# Altium project QUTMS_SteeringWheelV2-V00.PrjPcb
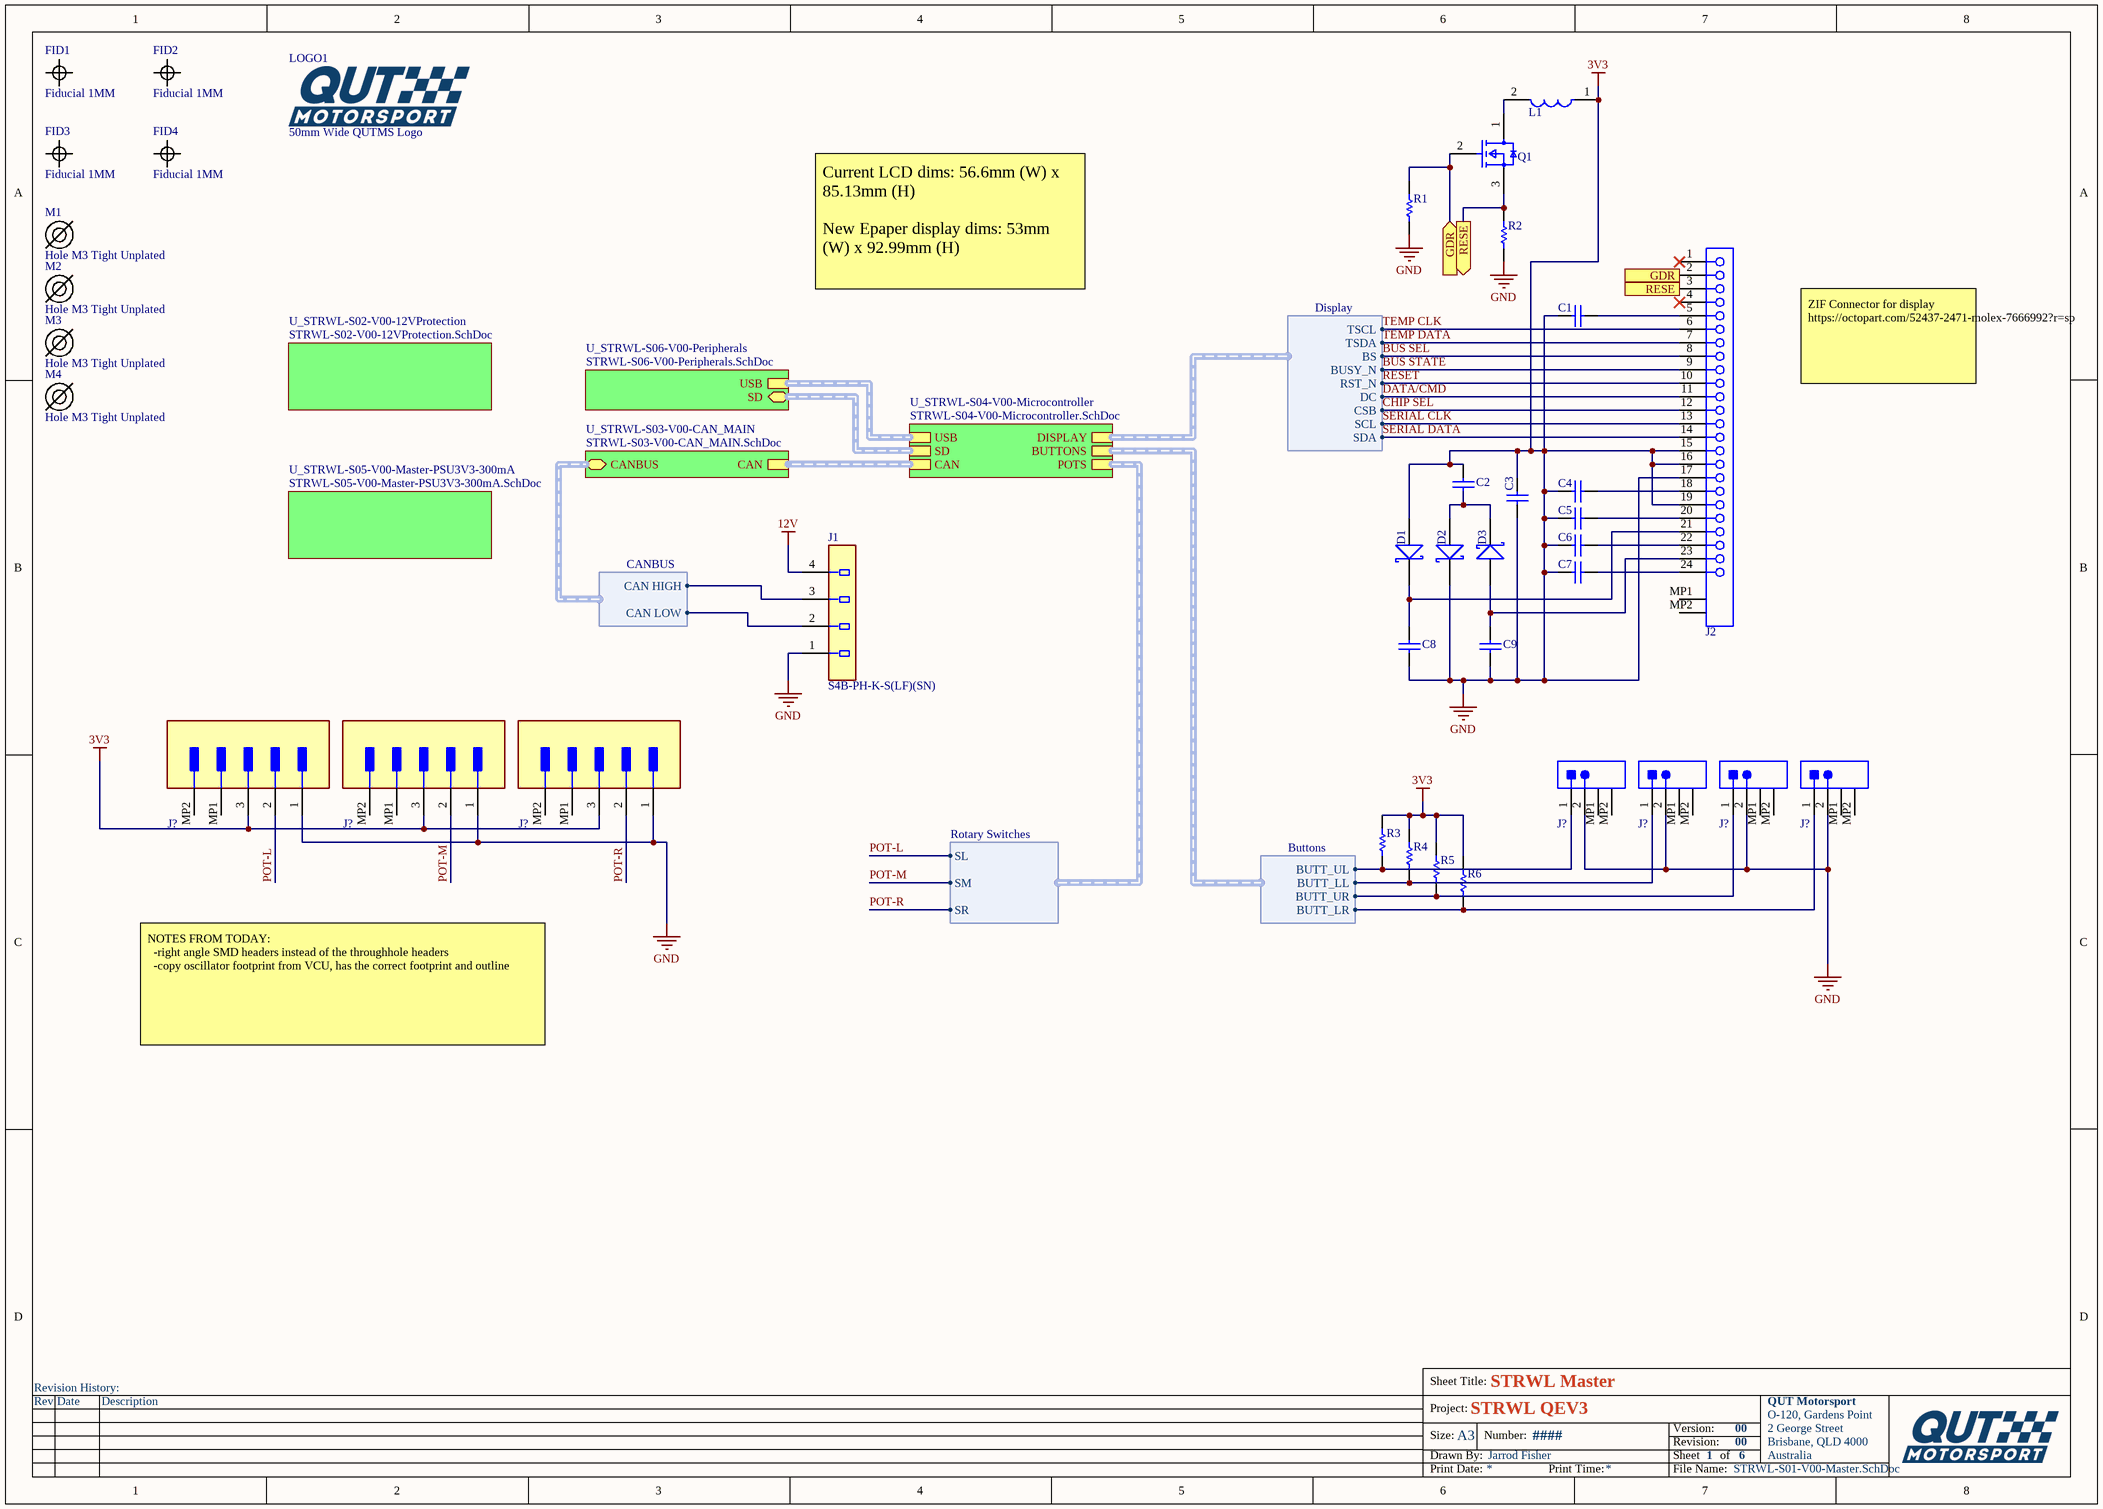
[diagram p0: STRWL-S01-V00-Master.SchDoc]
6 sheets, 118 parts. Net scope: hierarchical (ports join the sheet entries above them; power ports are global).
Board file: STRWL-P01-V00.PcbDoc
Sheets:
  STRWL-S01-V00-Master.SchDoc
    U_STRWL-S02-V00-12VProtection = STRWL-S02-V00-12VProtection.SchDoc
    U_STRWL-S03-V00-CAN_MAIN = STRWL-S03-V00-CAN_MAIN.SchDoc
    U_STRWL-S04-V00-Microcontroller = STRWL-S04-V00-Microcontroller.SchDoc
    U_STRWL-S05-V00-Master-PSU3V3-300mA = STRWL-S05-V00-Master-PSU3V3-300mA.SchDoc
    U_STRWL-S06-V00-Peripherals = STRWL-S06-V00-Peripherals.SchDoc

## Sheet STRWL-S01-V00-Master.SchDoc: STRWL Master
size A3; DrawnBy: Jarrod Fisher; Organization: QUT Motorsport; Address1: O-120, Gardens Point; Address2: 2 George Street; Address3: Brisbane, QLD 4000; Address4: Australia; DocumentNumber: ####; Revision: 00; SheetNumber: 1; SheetTotal: 6; Version: 00; Project: STRWL QEV3; PageSetup: Record=PageOptions|CenterHorizontal=True|CenterVertical=True|PrintScale=0.97|XCorrection=1.00|YCorrection=1.00|PrintKind=0|BorderSize=5000000|LeftOffset=0|BottomOffset=0|Orientation=2|PaperLength=1000|PaperWidth=1000|Scale=100|PaperSource=7|PrintQuality=-4|MediaType=1|DitherType=10|PaperKind=A4|PrintScaleMode=1

### Parts
(Parts that share a designator on the sheet are numbered #1, #2 ... from top to bottom, then left to right.)
C1  1uF 25V 5% X7R 0603  [Cap_Ceramic_0603]  (value not drawn)
C2  4u7 50V 5% X7R 0603  [Cap_Ceramic_0603]  (value not drawn)
C3  1uF 25V 5% X7R 0603  [Cap_Ceramic_0603]  (value not drawn)
C4  1uF 25V 5% X7R 0603  [Cap_Ceramic_0603]  (value not drawn)
C5  1uF 25V 5% X7R 0603  [Cap_Ceramic_0603]  (value not drawn)
C6  1uF 25V 5% X7R 0603  [Cap_Ceramic_0603]  (value not drawn)
C7  1uF 25V 5% X7R 0603  [Cap_Ceramic_0603]  (value not drawn)
C8  1uF 25V 5% X7R 0603  [Cap_Ceramic_0603]  (value not drawn)
C9  1uF 25V 5% X7R 0603  [Cap_Ceramic_0603]  (value not drawn)
D1  STPS0530Z  [SOD123]  (value not drawn)
D2  STPS0530Z  [SOD123]  (value not drawn)
D3  STPS0530Z  [SOD123]  (value not drawn)
FID1  Fiducial 1MM  [FIDUCIAL 1MM]  (no BOM)
FID2  Fiducial 1MM  [FIDUCIAL 1MM]  (no BOM)
FID3  Fiducial 1MM  [FIDUCIAL 1MM]  (no BOM)
FID4  Fiducial 1MM  [FIDUCIAL 1MM]  (no BOM)
J1  Part Number: S4B-PH-K-S(LF)(SN)  [JST_S4B-PH-K-S_LF_SN_0]  (hidden comment: JST PH 4 Way Through Hole Header)
J2  52437-2471  [MOLX-52437-2471]  (value not drawn)
J?#1  JST PH 3 Way SMD Header  (value not drawn)
J?#2  JST PH 3 Way SMD Header  (value not drawn)
J?#3  JST PH 3 Way SMD Header  (value not drawn)
J?#4  JST PH 2 Way SMD Header  [JST- S2B-PH-SM4-TB(LF)(SN)-2_V]  (value not drawn)
J?#5  JST PH 2 Way SMD Header  [JST- S2B-PH-SM4-TB(LF)(SN)-2_V]  (value not drawn)
J?#6  JST PH 2 Way SMD Header  [JST- S2B-PH-SM4-TB(LF)(SN)-2_V]  (value not drawn)
J?#7  JST PH 2 Way SMD Header  [JST- S2B-PH-SM4-TB(LF)(SN)-2_V]  (value not drawn)
L1  LQM21FN100M70L  [Murata_LQM21FN_70_MFG]  (value not drawn)
LOGO1  50mm Wide QUTMS Logo  [QUTMS LOGO 10MM]  (no BOM)
M1  Hole M3 Tight Unplated  [M3.2 UNPLATED]
M2  Hole M3 Tight Unplated  [M3.2 UNPLATED]
M3  Hole M3 Tight Unplated  [M3.2 UNPLATED]
M4  Hole M3 Tight Unplated  [M3.2 UNPLATED]
Q1  MOSFET N-CH 30V 4A SOT323  [Diodes_SOT323_0]  (value not drawn)
R1  10k 1% 0603  [Res_ThinFilm_0603]  (value not drawn)
R2  0R47 5% 0603  [Res_ThinFilm_0603]  (value not drawn)
R3  10k 5% 0603  [Res_ThinFilm_0603]  (value not drawn)
R4  10k 5% 0603  [Res_ThinFilm_0603]  (value not drawn)
R5  10k 5% 0603  [Res_ThinFilm_0603]  (value not drawn)
R6  10k 5% 0603  [Res_ThinFilm_0603]  (value not drawn)

### Sub-sheets
U_STRWL-S02-V00-12VProtection = STRWL-S02-V00-12VProtection.SchDoc: no entries
U_STRWL-S03-V00-CAN_MAIN = STRWL-S03-V00-CAN_MAIN.SchDoc: CANBUS (bidir, harness CANBUS), CAN (harness CAN)
U_STRWL-S04-V00-Microcontroller = STRWL-S04-V00-Microcontroller.SchDoc: USB (harness USB), SD (harness SD), CAN (harness CAN), DISPLAY (harness Display), BUTTONS (harness Buttons), POTS (harness Rotary Switches)
U_STRWL-S05-V00-Master-PSU3V3-300mA = STRWL-S05-V00-Master-PSU3V3-300mA.SchDoc: no entries
U_STRWL-S06-V00-Peripherals = STRWL-S06-V00-Peripherals.SchDoc: USB (harness USB), SD (bidir, harness SD)

### Ports
GDR (in), GDR (out), RESE (in), RESE (out)

### Harnesses
CANBUS: CAN HIGH, CAN LOW
Display: CSB, SCL, SDA, TSCL, TSDA, BS, BUSY_N, RST_N, DC
Buttons: BUTT_UL, BUTT_LL, BUTT_UR, BUTT_LR
Rotary Switches: SL, SM, SR

### Nets
3V3: C1.1 C2.2 C3.1 C3.2 C4.1 C5.1 C6.1 C7.1 C8.1 C9.1 D1.A D2.K J1.1 J2.15 J2.16 J2.17 J2.19 J?#1.1 J?#1.3 J?#2.1 J?#2.3 J?#3.1 J?#3.3 J?#4.2 J?#5.2 J?#6.2 J?#7.2 L1.1 R1.2 R2.1 R3.1 R4.1 R5.2 R6.2  [also labelled GND]
12V: J1.4
BUS SEL: J2.8 ; sheet U_STRWL-S04-V00-Microcontroller/DISPLAY.BS
BUS STATE: J2.9 ; sheet U_STRWL-S04-V00-Microcontroller/DISPLAY.BUSY_N
BUTTON-LOW-LEFT: J?#5.1 R4.2 ; sheet U_STRWL-S04-V00-Microcontroller/BUTTONS.BUTT_LL
BUTTON-LOW-RIGHT: J?#7.1 R6.1 ; sheet U_STRWL-S04-V00-Microcontroller/BUTTONS.BUTT_LR
BUTTON-UP-LEFT: J?#4.1 R3.2 ; sheet U_STRWL-S04-V00-Microcontroller/BUTTONS.BUTT_UL
BUTTON-UP-RIGHT: J?#6.1 R5.1 ; sheet U_STRWL-S04-V00-Microcontroller/BUTTONS.BUTT_UR
CHIP SEL: J2.12 ; sheet U_STRWL-S04-V00-Microcontroller/DISPLAY.CSB
DATA/CMD: J2.11 ; sheet U_STRWL-S04-V00-Microcontroller/DISPLAY.DC
POT-L: J?#1.2 ; sheet U_STRWL-S04-V00-Microcontroller/POTS.SL
POT-M: J?#2.2 ; sheet U_STRWL-S04-V00-Microcontroller/POTS.SM
POT-R: J?#3.2 ; sheet U_STRWL-S04-V00-Microcontroller/POTS.SR
RESET: J2.10 ; sheet U_STRWL-S04-V00-Microcontroller/DISPLAY.RST_N
SERIAL CLK: J2.13 ; sheet U_STRWL-S04-V00-Microcontroller/DISPLAY.SCL
SERIAL DATA: J2.14 ; sheet U_STRWL-S04-V00-Microcontroller/DISPLAY.SDA
TEMP CLK: J2.6 ; sheet U_STRWL-S04-V00-Microcontroller/DISPLAY.TSCL
TEMP DATA: J2.7 ; sheet U_STRWL-S04-V00-Microcontroller/DISPLAY.TSDA
NetC1_2: C1.2 J2.5
NetC2_1: C2.1 D2.A D3.K
NetC4_2: C4.2 J2.18
NetC5_2: C5.2 J2.20
NetC6_2: C6.2 J2.22
NetC7_2: C7.2 J2.24
NetC8_2: C8.2 D1.K J2.21
NetC9_2: C9.2 D3.A J2.23
NetJ1_2: J1.2 ; sheet U_STRWL-S03-V00-CAN_MAIN/CANBUS.CAN LOW
NetJ1_3: J1.3 ; sheet U_STRWL-S03-V00-CAN_MAIN/CANBUS.CAN HIGH
NetJ2_2: J2.2 Q1.2(G) R1.1 ; port GDR
NetJ2_3: J2.3 Q1.3(S) R2.2 ; port RESE
NetL1_2: L1.2 Q1.1(D)

Not connected (* = marked no-connect by the designer): J2 1* 4* MP1 MP2; J?#1 MP1(MNT_1) MP2(MNT_2); J?#2 MP1(MNT_1) MP2(MNT_2); J?#3 MP1(MNT_1) MP2(MNT_2); J?#4 MP1 MP2; J?#5 MP1 MP2; J?#6 MP1 MP2; J?#7 MP1 MP2

### Buses and harness runs
harness sheet U_STRWL-S03-V00-CAN_MAIN/CAN = sheet U_STRWL-S04-V00-Microcontroller/CAN
harness sheet U_STRWL-S04-V00-Microcontroller/SD = sheet U_STRWL-S06-V00-Peripherals/SD
harness sheet U_STRWL-S04-V00-Microcontroller/USB = sheet U_STRWL-S06-V00-Peripherals/USB

### Notes on the sheet
- Current LCD dims: 56.6mm (W) x 85.13mm (H)
  New Epaper display dims: 53mm (W) x 92.99mm (H)
- ZIF Connector for display
  https://octopart.com/52437-2471-molex-7666992?r=sp
- NOTES FROM TODAY:
  -right angle SMD headers instead of the throughhole headers
  -copy oscillator footprint from VCU, has the correct footprint and outline
- Revision History:
- Sheet Title:
- Rev
- Date
- Description
- Project:
- Size:
- Drawn By:
- A3
- Number:
- Revision:
- Sheet
- Version:
- of
- QUT Motorsport
- O-120, Gardens Point
- 2 George Street
- Brisbane, QLD 4000
- Australia
- Print Date:
- Print Time:
- File Name:

### Library data of the parts
C1 C3-C9 = 1uF 25V 5% X7R 0603: Capacitor, Ceramic, SMD, 1uF, 25V, 5%, X7R, 0603
C2 = 4u7 50V 5% X7R 0603: Capacitor, Ceramic, SMD, 4u7, 50V, 5%, X7R, 0603
D1-D3 = STPS0530Z: Diode, Schottky Barrier Rectifier, 30 V, 0.5 A, STPS0530Z
J2 = 52437-2471: 0.5 mm Pitch Easy-On(TM) Type FPC Connector, Right Angle, ZIF, SMT, Bottom Contact, 24 Circuits, -40 to 85 degC, ELV and RoHS Compliant, Tape and Reel; Manufacturer: Molex; Durability (mating cycles max): 20; Material - Metal: Phosphor Bronze; Polarized to PCB: Yes; Voltage (Max): 50V; Entry Angle: 90degrees Angle; PCB Locator: No; Material - Plating Termination: Gold; Current (Max per Contact): 0.5A; PCB Retention: None; Pitch - Mating Interface: 0.50mm; Circuits (Loaded): 24; Contact Position: Bottom; PartNumber: 52437-2471; ComponentLink1Description: Manufacturer URL; ComponentLink2Description: Datasheet; ComponentLink3URL: http://www.molex.com/pdm_docs/sd/524372471_sd.pdf; ComponentLink3Description: Package Specification; ComponentLink1URL: http://www.molex.com/molex/index.jsp; Packing: Tape and Reel; Number of Rows: 1; ComponentLink2URL: http://www.molex.com/webdocs/datasheets/pdf/en-us/0524372471_FFC_FPC_CONNECTORS.pdf; PackageVersion: Rev. E, 07/2013; RoHS: TRUE; Material - Plating Mating: Gold; Orientation: Right Angle; Stackable: No; Mounting Technology: Surface Mount; PackageReference: 52437-2471; PackageDescription: 24-Lead FPC Connector, Pitch 0.5 mm
J?#4-J?#7 = JST PH 2 Way SMD Header: PartNumber: S2B-PH-SM4-TB(LF)(SN); Current Rating: 3 A; RoHSCompliant: True; Min Operating Temperature: -65degC; Width: 2.34 mm; Pins: 40; ComponentLink1Description: Manufacturer URL; ComponentLink2Description: Datasheet; DatasheetVersion: Dec-12; ComponentLink1URL: http://www.jst.com/home2.html; Contact Plating: Tin; ComponentLink2URL: http://www.jst-mfg.com/product/pdf/eng/ePH.pdf; PackageReference: S2B-PH-SM4-TB(LF)(SN)-2; Mount: Through Hole; Contact Finish: Lead; Length: 101.19 mm; Radiation Hardening: No; Lead Pitch: 0.1 inch; Max Operating Temperature: 105degC; Colour: Black; Package Quantity: 100; Height: 8.13 mm; Packaging: Bulk; PackageDescription: Male Header, Pitch 2 mm, 1 x 2 Position, Height 5.5 mm; Contact Material: Bronze
L1 = LQM21FN100M70L: FIXED IND 10UH
LOGO1 = QUTMS Logo 50mm
M1-M4 = Hole M3 Tight Unplated: M3.2 Hole, No Plating
Q1 = DMN3065LW-13: N-Channel 30V 4A (Ta) 770mW (Ta) Surface Mount SOT-323
R1 = 10k 1% 0603: Resistor, SMD, 10k, 0.1W, 1%, 0603
R2 = 0R47 5% 0603_1: Resistor, SMD, 0R, 0.1W, 5%, 0603
R3-R6 = 10k 5% 0603: Resistor, SMD, 10k, 0.1W, 5%, 0603
J1 = JST PH 4 Way Through Hole Header: helpURL: https://upverter.com/upn/revision/a04d3038e6c69606/; ComponentLink2Description: Datasheet; Temperature: -25°C to +85°C; Package: HDR4; Supplier 2: Mouser; Price: 0.141609370397; Supplier 1: Digi-Key; ComponentLink1URL: https://upverter.com/upn/revision/a04d3038e6c69606/; Supplier Part Number 1: 455-1721-ND; Manufacturer: JST; ComponentLink1Description: Upverter; ComponentLink2URL: http://www.jst-mfg.com/product/pdf/eng/ePH.pdf; RoHS: TRUE; Temperature Range High: +85°C; Digikey Description: CONN HEADER PH SIDE 4POS 2MM; Digikey Part Number: 455-1721-ND; Temperature Range Low: -25°C; Lead Free: yes

## Sheet STRWL-S02-V00-12VProtection.SchDoc: 12V Protected Input
size A3; SheetNumber: 2; SheetTotal: 7
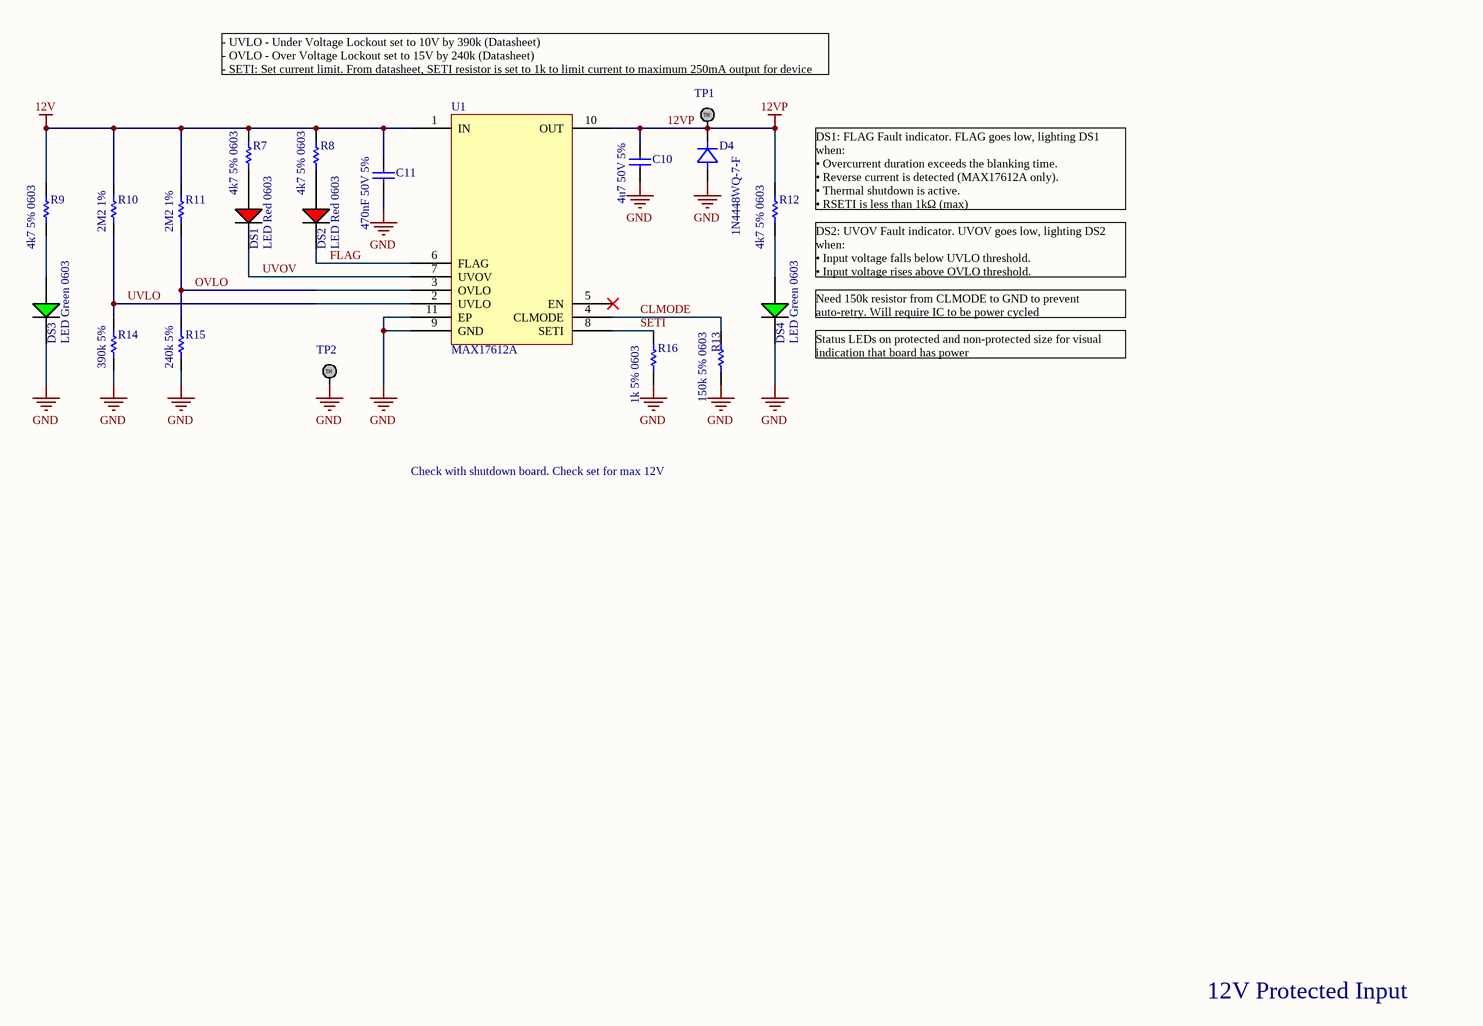
[diagram p1: STRWL-S02-V00-12VProtection.SchDoc]

### Parts
C10  4u7 50V 5%  [Cap_Ceramic_0603]
C11  470nF 50V 5%  [Cap_Ceramic_0603]
D4  1N4448WQ-7-F  [SMA]
DS1  LED Red 0603  [LED RED 0603]
DS2  LED Red 0603  [LED RED 0603]
DS3  LED Green 0603  [LED GREEN 0603]
DS4  LED Green 0603  [LED GREEN 0603]
R7  4k7 5% 0603  [Res_ThinFilm_0603]
R8  4k7 5% 0603  [Res_ThinFilm_0603]
R9  4k7 5% 0603  [Res_ThinFilm_0603]
R10  2M2 1%  [Res_ThinFilm_0603]
R11  2M2 1%  [Res_ThinFilm_0603]
R12  4k7 5% 0603  [Res_ThinFilm_0603]
R13  150k 5% 0603  [Res_ThinFilm_0603]
R14  390k 5%  [Res_ThinFilm_0603]
R15  240k 5%  [Res_ThinFilm_0603]
R16  1k 5% 0603  [Res_ThinFilm_0603]
TP1  TestPoint  [TestPointSMD]  (value not drawn)
TP2  TestPoint  [TestPointSMD]  (value not drawn)
U1  MAX17612A  [MAX17612A]

### Nets
12V: C11.2 R7.2 R8.2 R9.2 R10.2 R11.2 U1.1(IN)
12VP: C10.2 D4.K(Cathode) R12.2 TP1.1 U1.10(OUT)
GND: C10.1 C11.1 D4.A(Anode) DS3.2(C) DS4.2(C) R13.1 R14.1 R15.1 R16.1 TP2.1 U1.9(GND) U1.11(EP)  [project net 3V3]
CLMODE: R13.2 U1.4(CLMODE)
FLAG: DS2.2(C) U1.6(FLAG)
OVLO: R11.1 R15.2 U1.3(OVLO)
SETI: R16.2 U1.8(SETI)
UVLO: R10.1 R14.2 U1.2(UVLO)
UVOV: DS1.2(C) U1.7(UVOV)
NetDS1_1: DS1.1(A) R7.1
NetDS2_1: DS2.1(A) R8.1
NetDS3_1: DS3.1(A) R9.1
NetDS4_1: DS4.1(A) R12.1

Not connected (* = marked no-connect by the designer): U1 5(EN)*

### Notes on the sheet
- - UVLO - Under Voltage Lockout set to 10V by 390k (Datasheet)
  - OVLO - Over Voltage Lockout set to 15V by 240k (Datasheet)
  - SETI: Set current limit. From datasheet, SETI resistor is set to 1k to limit current to maximum 250mA output for device
- (near R12) DS1: FLAG Fault indicator. FLAG goes low, lighting DS1 when:
  • Overcurrent duration exceeds the blanking time.
  • Reverse current is detected (MAX17612A only).
  • Thermal shutdown is active.
  • RSETI is less than 1kΩ (max)
- DS2: UVOV Fault indicator. UVOV goes low, lighting DS2 when:
  • Input voltage falls below UVLO threshold.
  • Input voltage rises above OVLO threshold.
- (near DS4) Need 150k resistor from CLMODE to GND to prevent auto-retry. Will require IC to be power cycled
- (near DS4) Status LEDs on protected and non-protected size for visual indication that board has power
- Check with shutdown board. Check set for max 12V
- 12V Protected Input
- (in symbol TestPoint) TH

### Library data of the parts
C10 = 4u7 50V 5% X7R 0603: as C2 on sheet STRWL-S01-V00-Master
C11 = 470nF 50V 5% X7R 0603: Capacitor, Ceramic, SMD, 470nF, 50V, 5%, X7R, 0603
D4 = 1N4448WQ-7-F: Diode, SMD, 75V, 5%, 250mA, SOD123; Manufacturer: ON Semiconductor / Fairchild; Manufacturer Part Number: 1N914BWS; Average Rectified Current: 150mA; Element Configuration: Single; Forward Voltage: 1V; Max Reverse Leakage Current: 5uA; Power Dissipation: 200mW; Recovery Time: 4ns; Max Forward Surge Current (Ifsm): 4A; Parameter 1: *; Weight: 0.0276g; Category: Rectifier Diodes; Contact Plating: Tin,Matte; Forward Current: 150mA; Lead Free: Lead Free; Max Operating Temperature: 150°C; Max Repetitive Reverse Voltage (Vrrm): 75V; Max Reverse Voltage (DC): 75V; Min Operating Temperature: -55°C; Mount: Surface Mount; Number of Pins: 2; Package Quantity: 1; Packaging: Tape and Reel; Peak Reverse Current: 5uA; Radiation Hardening: No; REACH SVHC: No SVHC; Reverse Recovery Time: 4ns; Height: 1mm; Length: 1.8mm; Reverse Voltage: 75V; Width: 1.35mm
R7-R9 R12 = 4k7 5% 0603: Resistor, SMD, 4k7, 0.1W, 5%, 0603
R10 R11 = 2M2 1% 0603: Resistor, SMD, 2M2, 0.125W, 1%, 0603
R13 = 150k 5%, 0603: Resistor, SMD, 150k, 0.1W, 5%, 0603
R14 = 390k 5% 0603: Resistor, SMD, 390k, 0.1W, 5%, 0603
R15 = 240k 5% 0603: Resistor, SMD, 240k, 0.1W, 5%, 0603
R16 = 1k 5% 0603: Resistor, SMD, 1k, 0.1W, 5%, 0603
U1 = MAX17612A: 4.5V to 60V, 250mA Current-Limiter with OV, UV, and Reverse Protection; ComponentLink1Description: Datasheet; ComponentLink1URL: https://datasheets.maximintegrated.com/en/ds/MAX17612A-MAX17612C.pdf

## Sheet STRWL-S03-V00-CAN_MAIN.SchDoc
size A3; SheetNumber: 3; SheetTotal: 6
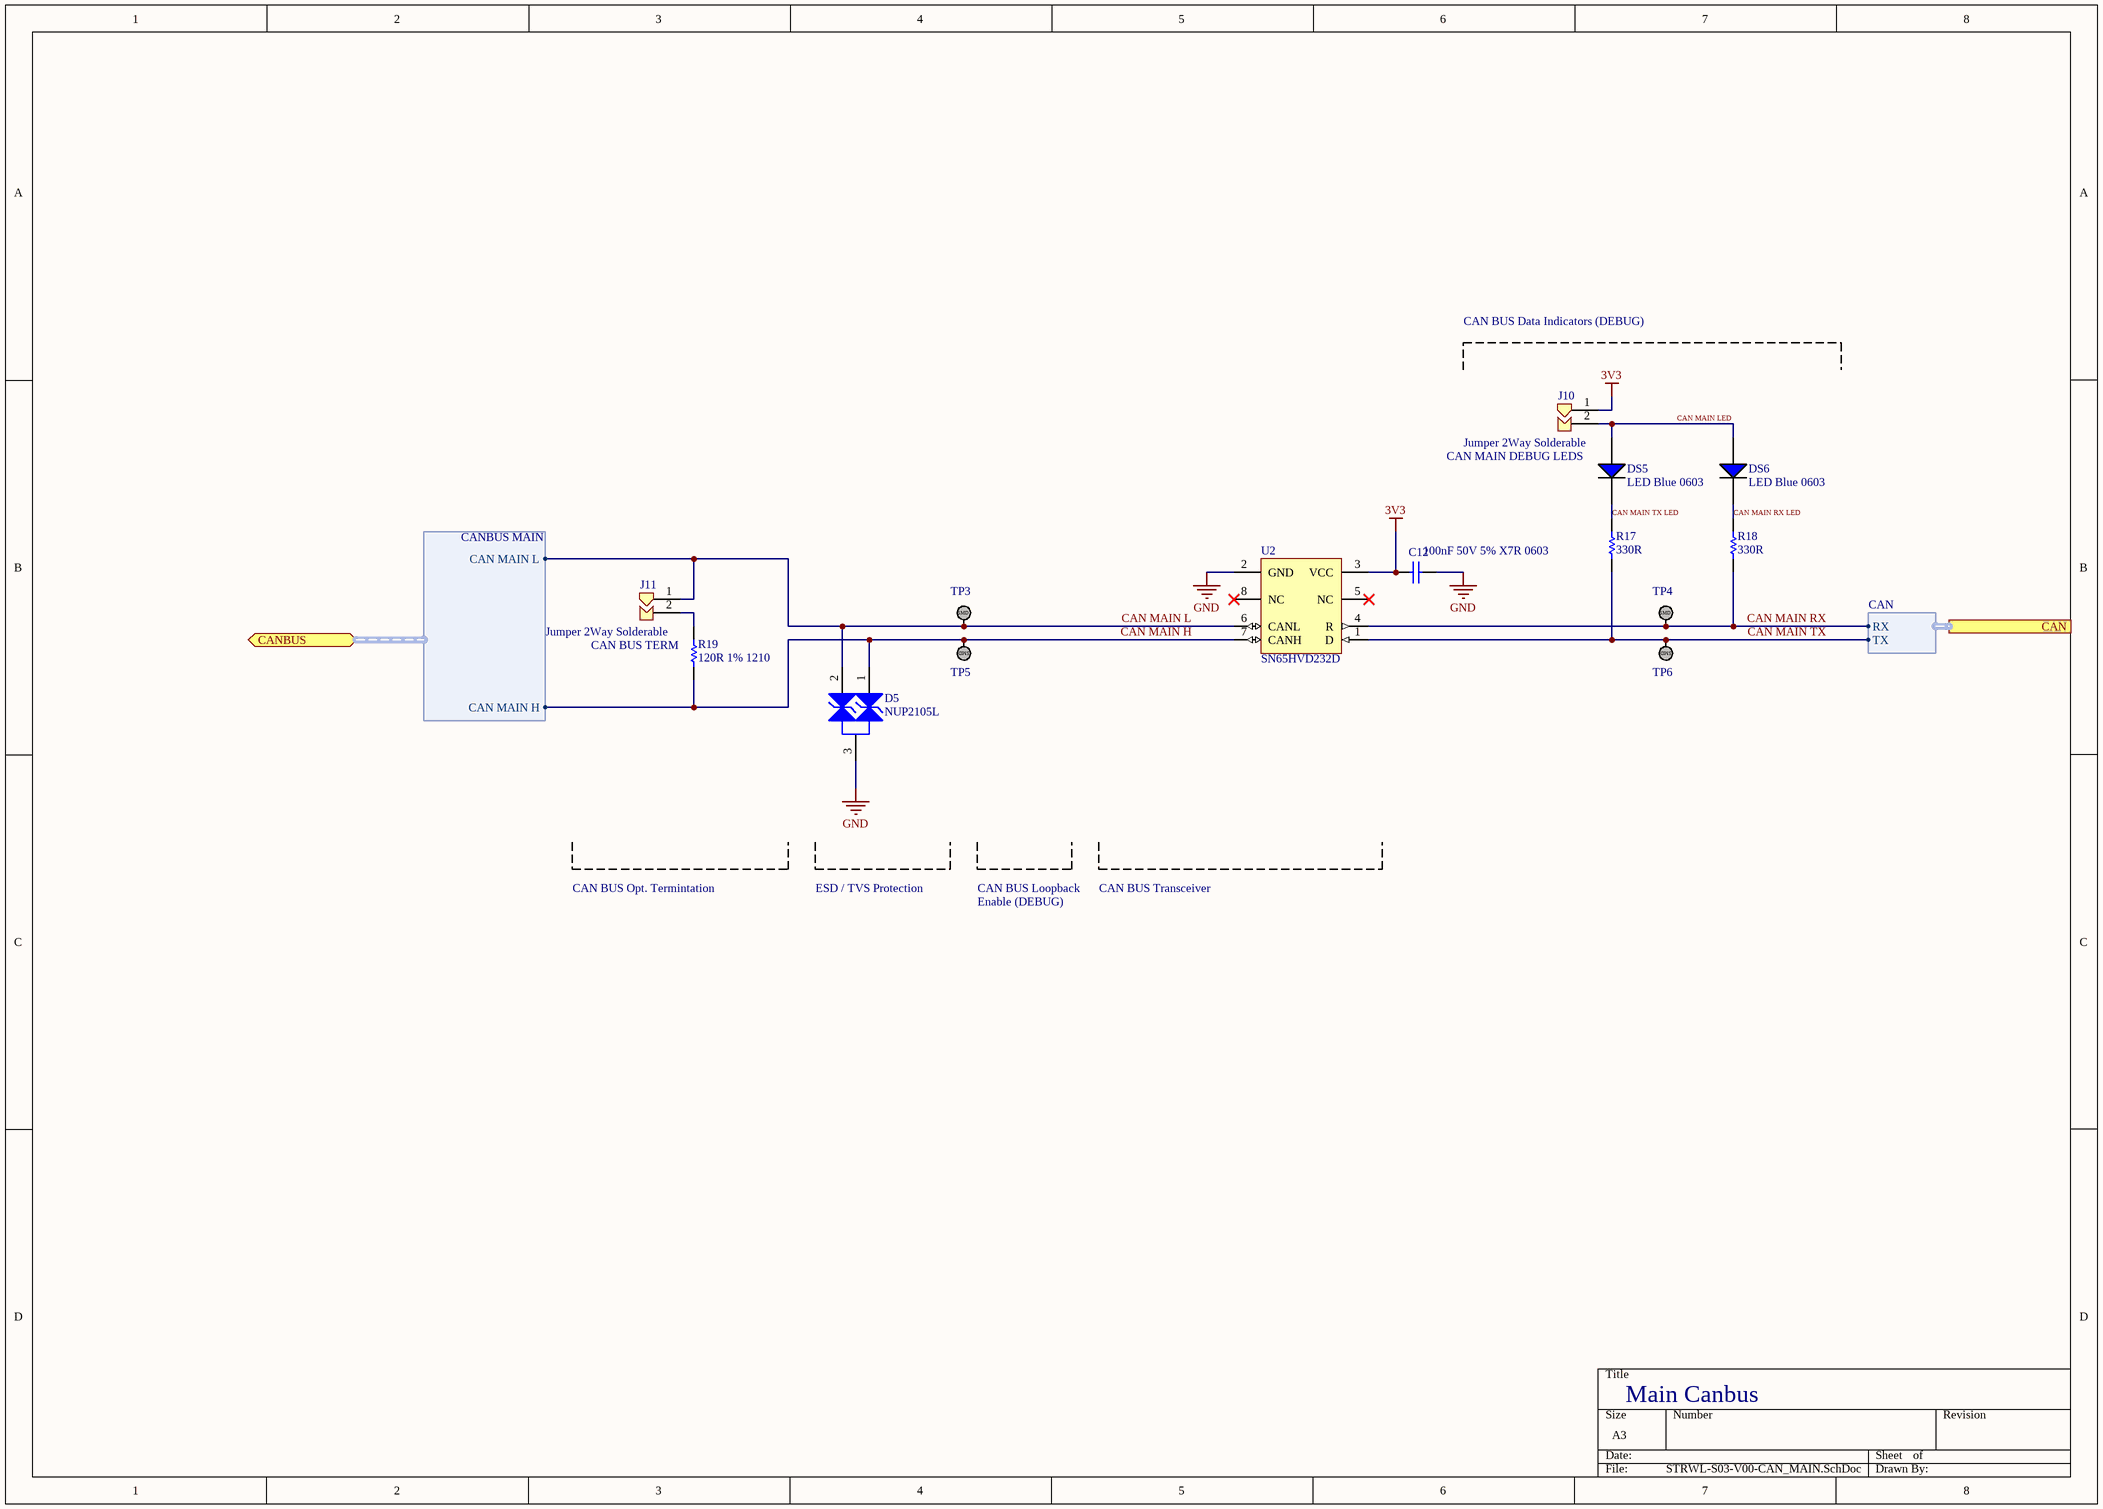
[diagram p2: STRWL-S03-V00-CAN_MAIN.SchDoc]

### Parts
C12  100nF 50V 5% X7R 0603  [Cap_Ceramic_0603]
D5  NUP2105L  [NUP2105L]
DS5  LED Blue 0603  [LED BLUE 0603]
DS6  LED Blue 0603  [LED BLUE 0603]
J10  Jumper 2Way Solderable  [Jumper_2Way_Solderable]
J11  Jumper 2Way Solderable  [Jumper_2Way_Solderable]
R17  330R  [Res_ThinFilm_0603]
R18  330R  [Res_ThinFilm_0603]
R19  120R 1% 1210  [Res_ThinFilm_1210]
TP3  TestPoint_SMD  [TestPointSMD]  (value not drawn)
TP4  TestPoint_SMD  [TestPointSMD]  (value not drawn)
TP5  TestPoint_SMD  [TestPointSMD]  (value not drawn)
TP6  TestPoint_SMD  [TestPointSMD]  (value not drawn)
U2  SN65HVD232D  [D0008A_L]

### Ports
CAN (harness CAN), CANBUS (bidir, harness CANBUS MAIN)

### Harnesses
CANBUS MAIN: CAN MAIN L, CAN MAIN H
CAN: TX, RX

### Nets
3V3: C12.1 C12.2 D5.3 J10.1 U2.2(GND) U2.3(VCC)  [also labelled GND]
CAN MAIN H: D5.1 R19.1 TP5.1 U2.7(CANH) ; port CANBUS.CAN MAIN H
CAN MAIN L: D5.2 J11.1 TP3.1 U2.6(CANL) ; port CANBUS.CAN MAIN L
CAN MAIN LED: DS5.1(A) DS6.1(A) J10.2
CAN MAIN RX: R18.1 TP4.1 U2.4(R) ; port CAN.RX  [project net CAN GLV RX]
CAN MAIN RX LED: DS6.2(C) R18.2
CAN MAIN TX: R17.1 TP6.1 U2.1(D) ; port CAN.TX  [project net CAN GLX TX]
CAN MAIN TX LED: DS5.2(C) R17.2
NetJ11_2: J11.2 R19.2

Not connected (* = marked no-connect by the designer): U2 5(NC)* 8(NC)*

### Notes on the sheet
- CAN BUS Data Indicators (DEBUG)
- CAN MAIN DEBUG LEDS
- (near R19) CAN BUS TERM
- CAN BUS Opt. Termintation
- ESD / TVS Protection
- CAN BUS Loopback
- Enable (DEBUG)
- CAN BUS Transceiver
- Main Canbus
- (in symbol TestPoint_SMD) SMD

### Library data of the parts
C12 = 100nF 50V 5% X7R 0603: Capacitor, Ceramic, SMD, 100nF, 50V, 5%, X7R, 0603
J10 J11 = Jumper 2Way Side Solderable
R17 R18 = 330R 5% 0603: Resistor, SMD, 330R, 0.1W, 5%, 0603
R19 = 120R 1% 1210: Resistor, SMD, 120R, 0.25W, 1%, 1210
U2 = CMP-0315-00073-2: 3.3 V CAN Transceiver, 17 mA, -40 to 85 degC, 8-pin SOIC (D), Green (RoHS & no Sb/Br); Manufacturer: Texas Instruments; Supply Voltage(s)(V): 3.3; Transient Pulse Protection(V): -25 to 25; ICC(Max)(mA): 17; Drivers Per Package: 1; Rating: Catalog; Code_JEDEC: MS-012AA; Mounting Technology: Surface Mount; PackageDescription: 8-Pin Plastic Small Outline Integrated Circuit, 4.9 x 3.9 mm, Pitch 1.27 mm Pitch; SubFamily: CAN; PackageVersion: revM, Jun-2011; Isolated: No; DatasheetVersion: SLOS346K; PackageReference: D0008A; Receivers Per Package: 1; Footprint: SN65HVD232; ComponentLink1Description: Datasheet; PartNumber: SN65HVD232D; Eco-Plan: Green (RoHS & no Sb/Br); ComponentLink1URL: http://www.ti.com/general/docs/lit/getliterature.tsp?genericPartNumber=SN65HVD232&fileType=pdf
D5 = NUP2105L: ComponentLink1Description: Datasheet; ComponentLink1URL: https://www.onsemi.cn/PowerSolutions/document/NUP2105L-D.PDF; Parameter 1: *; ComponentLink2Description: LCSC; ComponentLink2URL: https://lcsc.com/product-detail/TVS_ON-Semiconductor-NUP2105LT1G_C14486.html; ComponentLink3Description: Digikey; ComponentLink3URL: https://www.digikey.com.au/product-detail/en/on-semiconductor/SZNUP2105LT1G/SZNUP2105LT1GOSCT-ND/3487669

## Sheet STRWL-S04-V00-Microcontroller.SchDoc: STRWL Microcontroller
size A3; DrawnBy: John Hatfield; DocumentNumber: 4; Revision: 01; SheetNumber: 4; SheetTotal: 6; Version: 01; Project: STRWL QEV3; PageSetup: Record=PageOptions|CenterHorizontal=True|CenterVertical=True|PrintScale=0.97|XCorrection=1.00|YCorrection=1.00|PrintKind=0|BorderSize=5000000|LeftOffset=0|BottomOffset=0|Orientation=2|PaperLength=1000|PaperWidth=1000|Scale=100|PaperSource=7|PrintQuality=-4|MediaType=1|DitherType=10|PaperKind=A4|PrintScaleMode=1
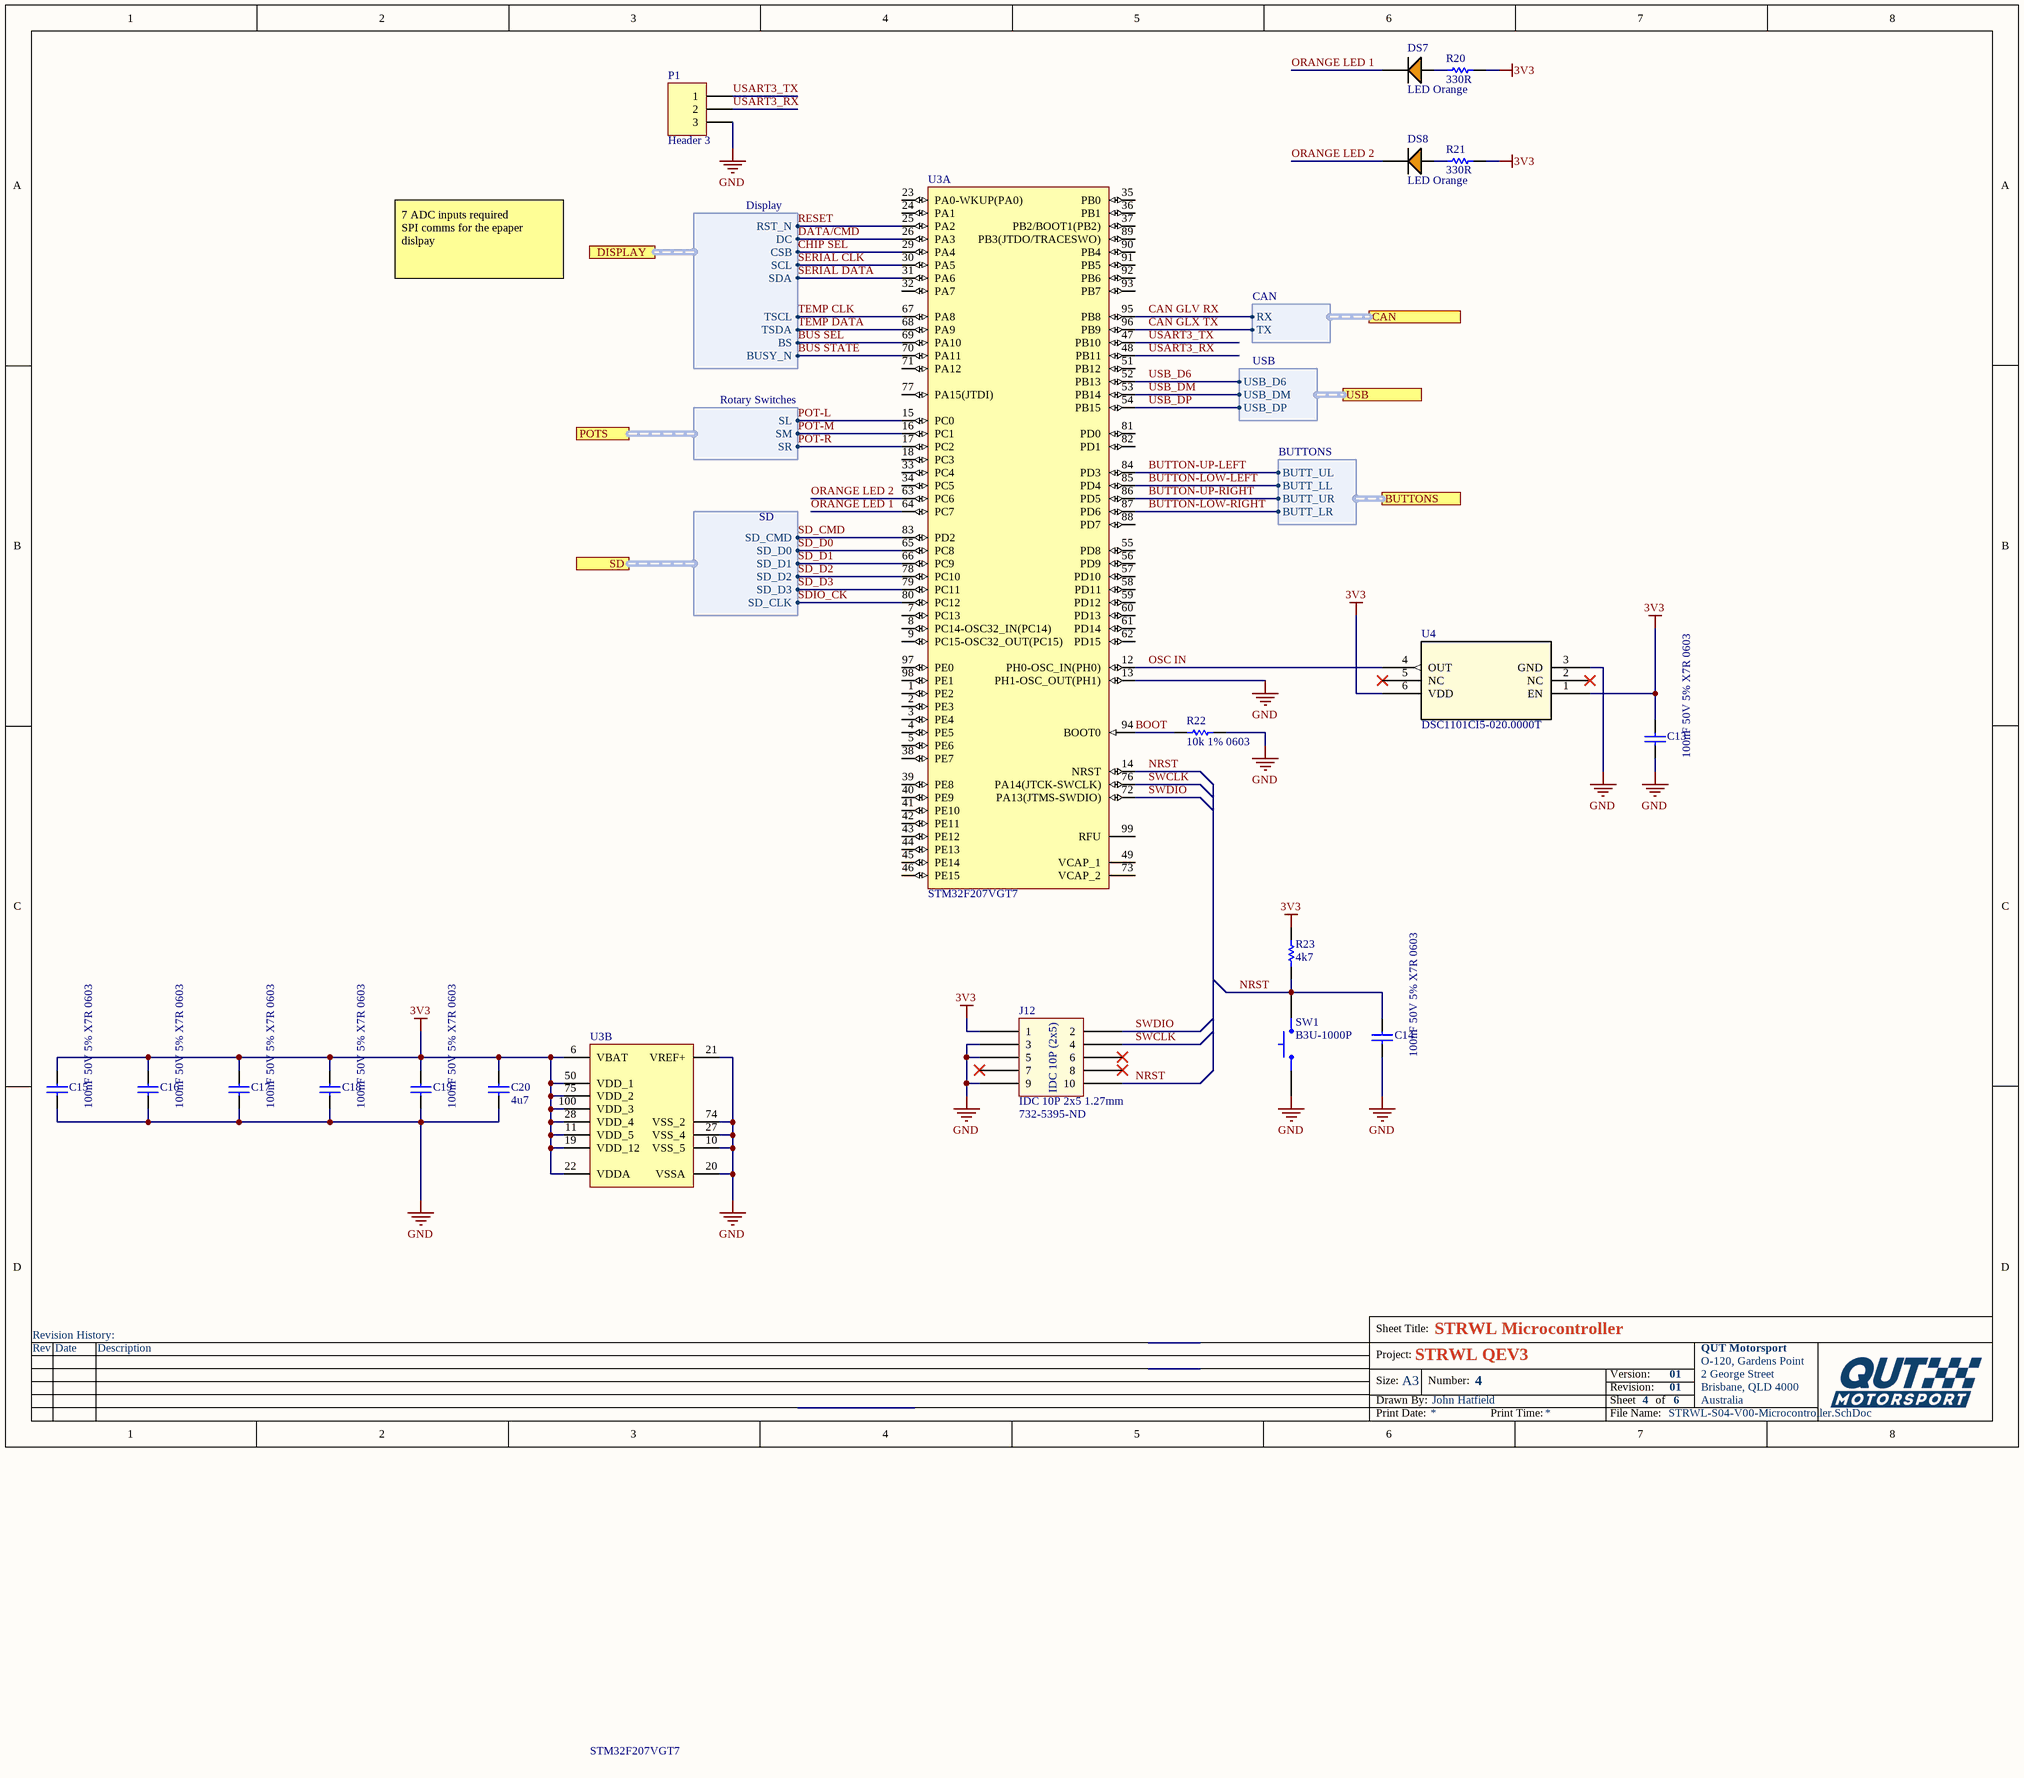
[diagram p3: STRWL-S04-V00-Microcontroller.SchDoc]

### Parts
C13  100nF 50V 5% X7R 0603  [Cap_Ceramic_0603]
C14  100nF 50V 5% X7R 0603  [Cap_Ceramic_0603]
C15  100nF 50V 5% X7R 0603  [Cap_Ceramic_0603]
C16  100nF 50V 5% X7R 0603  [Cap_Ceramic_0603]
C17  100nF 50V 5% X7R 0603  [Cap_Ceramic_0603]
C18  100nF 50V 5% X7R 0603  [Cap_Ceramic_0603]
C19  100nF 50V 5% X7R 0603  [Cap_Ceramic_0603]
C20  4u7  [Cap_Ceramic_0603]
DS7  LED Orange  [LED ORANGE 0603]
DS8  LED Orange  [LED ORANGE 0603]
J12  IDC 10P 2x5 1.27mm  [IDC 1.27MM 10P]
P1  Header 3  [HDR1X3]
R20  330R  [Res_ThinFilm_0603]
R21  330R  [Res_ThinFilm_0603]
R22  10k 1% 0603  [Res_ThinFilm_0603]
R23  4k7  [Res_ThinFilm_0603]
SW1  B3U-1000P  [BTN B3U-1000P]
U3  STM32F207VGT7  [STM-LQFP100_N]  (parts A,B of 2)
U4  DSC1101CI5-020.0000T  [VDFN6_3P2X2P5_MCH]

### Ports
BUTTONS (harness BUTTONS), CAN (harness CAN), DISPLAY (harness Display), POTS (harness Rotary Switches), SD (harness SD), USB (harness USB)

### Harnesses
CAN: RX, TX
USB: USB_DM, USB_DP, USB_D6
SD: SD_D0, SD_D1, SD_D2, SD_D3, SD_CLK, SD_CMD
Display: RST_N, DC, CSB, SCL, SDA, TSCL, TSDA, BS, BUSY_N
BUTTONS: BUTT_UL, BUTT_LL, BUTT_UR, BUTT_LR
Rotary Switches: SL, SM, SR

### Nets
3V3: C13.1 C13.2 C14.1 C15.1 C15.2 C16.1 C16.2 C17.1 C17.2 C18.1 C18.2 C19.1 C19.2 C20.1 C20.2 J12.1 J12.3 J12.5 J12.9 P1.3 R20.2 R21.2 R22.2 R23.2 SW1.1 U3.6(VBAT) U3.10(VSS_5) U3.11(VDD_5) U3.13(PH1-OSC_OUT(PH1)) U3.19(VDD_12) U3.20(VSSA) U3.21(VREF+) U3.22(VDDA) U3.27(VSS_4) U3.28(VDD_4) U3.50(VDD_1) U3.74(VSS_2) U3.75(VDD_2) U3.100(VDD_3) U4.1(EN) U4.3(GND) U4.6(VDD)  [also labelled GND]
BOOT: R22.1 U3.94(BOOT0)
BUS SEL: U3.69(PA10) ; port DISPLAY.BS
BUS STATE: U3.70(PA11) ; port DISPLAY.BUSY_N
BUTTON-LOW-LEFT: U3.85(PD4) ; port BUTTONS.BUTT_LL
BUTTON-LOW-RIGHT: U3.87(PD6) ; port BUTTONS.BUTT_LR
BUTTON-UP-LEFT: U3.84(PD3) ; port BUTTONS.BUTT_UL
BUTTON-UP-RIGHT: U3.86(PD5) ; port BUTTONS.BUTT_UR
CAN GLV RX: U3.95(PB8) ; port CAN.RX
CAN GLX TX: U3.96(PB9) ; port CAN.TX
CHIP SEL: U3.29(PA4) ; port DISPLAY.CSB
DATA/CMD: U3.26(PA3) ; port DISPLAY.DC
NRST: C14.2 J12.10 R23.1 SW1.2 U3.14(NRST)
ORANGE LED 1: DS7.2(C) U3.64(PC7)
ORANGE LED 2: DS8.2(C) U3.63(PC6)
OSC IN: U3.12(PH0-OSC_IN(PH0)) U4.4(OUT)
POT-L: U3.15(PC0) ; port POTS.SL
POT-M: U3.16(PC1) ; port POTS.SM
POT-R: U3.17(PC2) ; port POTS.SR
RESET: U3.25(PA2) ; port DISPLAY.RST_N
SD_CMD: U3.83(PD2) ; port SD.SD_CMD
SD_D0: U3.65(PC8) ; port SD.SD_D0
SD_D1: U3.66(PC9) ; port SD.SD_D1
SD_D2: U3.78(PC10) ; port SD.SD_D2
SD_D3: U3.79(PC11) ; port SD.SD_D3
SDIO_CK: U3.80(PC12) ; port SD.SD_CLK
SERIAL CLK: U3.30(PA5) ; port DISPLAY.SCL
SERIAL DATA: U3.31(PA6) ; port DISPLAY.SDA
SWCLK: J12.4 U3.76(PA14(JTCK-SWCLK))
SWDIO: J12.2 U3.72(PA13(JTMS-SWDIO))
TEMP CLK: U3.67(PA8) ; port DISPLAY.TSCL
TEMP DATA: U3.68(PA9) ; port DISPLAY.TSDA
USART3_RX: P1.2 U3.48(PB11)
USART3_TX: P1.1 U3.47(PB10)
USB_D6: U3.52(PB13) ; port USB.USB_D6
USB_DM: U3.53(PB14) ; port USB.USB_DM  [project net USB DM]
USB_DP: U3.54(PB15) ; port USB.USB_DP  [project net USB DP]
NetDS7_1: DS7.1(A) R20.1
NetDS8_1: DS8.1(A) R21.1

Not connected (* = marked no-connect by the designer): J12 6* 7* 8*; U3 1(PE2) 2(PE3) 3(PE4) 4(PE5) 5(PE6) 7(PC13) 8(PC14-OSC32_IN(PC14)) 9(PC15-OSC32_OUT(PC15)) 18(PC3) 23(PA0-WKUP(PA0)) 24(PA1) 32(PA7) 33(PC4) 34(PC5) 35(PB0) 36(PB1) 37(PB2/BOOT1(PB2)) 38(PE7) 39(PE8) 40(PE9) 41(PE10) 42(PE11) 43(PE12) 44(PE13) 45(PE14) 46(PE15) 49(VCAP_1) 51(PB12) 55(PD8) 56(PD9) 57(PD10) 58(PD11) 59(PD12) 60(PD13) 61(PD14) 62(PD15) 71(PA12) 73(VCAP_2) 77(PA15(JTDI)) 81(PD0) 82(PD1) 88(PD7) 89(PB3(JTDO/TRACESWO)) 90(PB4) 91(PB5) 92(PB6) 93(PB7) 97(PE0) 98(PE1) 99(RFU); U4 2(NC)* 5(NC)*

### Notes on the sheet
- 7 ADC inputs required
  SPI comms for the epaper dislpay
- (near J12) 732-5395-ND
- Revision History:
- Sheet Title:
- Rev
- Date
- Description
- Project:
- Size:
- Drawn By:
- A3
- Number:
- Revision:
- Sheet
- Version:
- of
- QUT Motorsport
- O-120, Gardens Point
- 2 George Street
- Brisbane, QLD 4000
- Australia
- Print Date:
- Print Time:
- File Name:
- (in symbol IDC 10P 2x5 1.27mm) IDC 10P (2x5)

### Library data of the parts
C13-C19 = 100nF 50V 5% X7R 0603: as C12 on sheet STRWL-S03-V00-CAN_MAIN
C20 = 4u7 50V 5% X7R 0603: as C2 on sheet STRWL-S01-V00-Master
DS7 DS8 = LED ORANGE 0603
P1 = Header 3: Header, 3-Pin; LatestRevisionDate: 17-Jul-2002; LatestRevisionNote: Re-released for DXP Platform.; Publisher: Altium Limited
R20 R21 = 330R 5% 0603: Resistor, SMD, 330R, 0.1W, 5%, 0603
R22 = 20k 1% 0603: Resistor, SMD, 20k, 0.1W, 5%, 0603
R23 = 4k7 5% 0603: Resistor, SMD, 4k7, 0.1W, 5%, 0603
SW1 = BTN B3U-1000P: Omron B3U-1000P Ultra Miniture Switch; ComponentLink1Description: LCSC; ComponentLink1URL: https://lcsc.com/product-detail/Tactile-Switches_BRIGHT-TSA063G50-250_C294565.html
U3 = STM32F207VGT7-Custom: ARM Cortex-M3 32-bit MCU, 1024 KB Flash, 128 KB Internal RAM, 82 I/Os, 100-pin LQFP, -40 to 105 degC, Tray; D/A Converter: 2x12-bit (2 Channel); Internal RAM Size (kB): 128; Supply Voltage(Vcc) min (V): 1.8; I/Os (High Current): 82; Operating Frequency(F) (Processor speed) (MHz): 120; FLASH Size (Prog) (kB): 1024; PartNumber: STM32F207VGT7; DatasheetVersion: Rev. 9; Core: ARM Cortex-M3; ComponentLink3Description: Package Specification; ComponentLink3URL: http://www.st.com/st-web-ui/static/active/en/resource/technical/document/data_brief/DM00071938.pdf; PackageDescription: 100-Pin Low Profile Quad Flat Package, 14 x 14 mm Body, 0.5 mm Pitch; ComponentLink1Description: Manufacturer URL; PackageVersion: Rev. 1, 06/2013; ComponentLink1URL: http://www.st.com/web/en/home.html; PackageReference: LQFP100; ComponentLink2Description: Datasheet; ComponentLink2URL: http://www.st.com/st-web-ui/static/active/en/resource/technical/document/datasheet/CD00237391.pdf; Mounting Technology: Surface Mount; Packing: Tray
U4 = DSC1101CI5-020.0000T: No Description Available; Vendor: Microchip; Built_By: EMA_Jessica; SourceLibrary: Microchip_2019-08-23_23; Manufacturer_Part_Number: DSC1101CI5-020.0000T; Copyright: Copyright (C) 2018 Accelerated Designs. All rights reserved; RefDes: RefDes; Type: DEV

## Sheet STRWL-S05-V00-Master-PSU3V3-300mA.SchDoc: Power Supply (20-40V to 3v3 @ 0.1-0.6A)
size A3; DrawnBy: Jonn Dillon; DocumentNumber: 2; Revision: 01; SheetNumber: 5; SheetTotal: 7; Version: 01; Project: AMU 2020 (Sourced from BMS 2020); PageSetup: Record=PageOptions|CenterHorizontal=True|CenterVertical=True|PrintScale=0.97|XCorrection=1.00|YCorrection=1.00|PrintKind=0|BorderSize=5000000|LeftOffset=0|BottomOffset=0|Orientation=2|PaperLength=1000|PaperWidth=1000|Scale=100|PaperSource=7|PrintQuality=-4|MediaType=1|DitherType=10|PaperKind=A4|PrintScaleMode=1
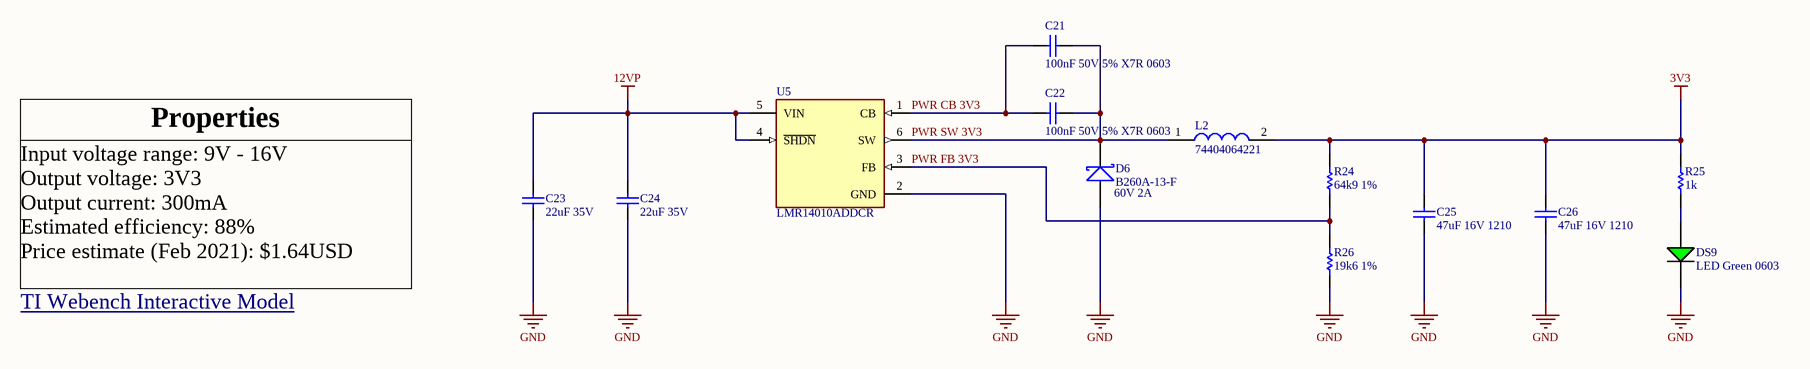
[diagram p4: STRWL-S05-V00-Master-PSU3V3-300mA.SchDoc]

### Parts
C21  100nF 50V 5% X7R 0603  [Cap_Ceramic_0603]
C22  100nF 50V 5% X7R 0603  [Cap_Ceramic_0603]
C23  22uF 35V  [Cap_Ceramic_1206]
C24  22uF 35V  [Cap_Ceramic_1206]
C25  47uF 16V 1210  [Cap_Ceramic_1210]
C26  47uF 16V 1210  [Cap_Ceramic_1210]
D6  B260A-13-F  [SMA]
DS9  LED Green 0603  [LED GREEN 0603]
L2  74404064221  [Inductor_6x6mm]
R24  64k9 1%  [Res_ThinFilm_0603]
R25  1k  [Res_ThinFilm_0603]
R26  19k6 1%  [Res_ThinFilm_0603]
U5  LMR14010ADDCR  [FP-DDC0006A-MFG]

### Nets
3V3: C23.2 C24.2 C25.1 C25.2 C26.1 C26.2 D6.A DS9.2(C) L2.2 R24.2 R25.2 R26.1 U5.2(GND)  [also labelled GND]
12VP: C23.1 C24.1 U5.4(~{SHDN}) U5.5(VIN)
PWR CB 3V3: C21.1 C22.1 U5.1(CB)
PWR FB 3V3: R24.1 R26.2 U5.3(FB)
PWR SW 3V3: C21.2 C22.2 D6.K L2.1 U5.6(SW)
NetDS9_1: DS9.1(A) R25.1

### Notes on the sheet
- Properties
- (near D6) 60V 2A
- Input voltage range: 9V - 16V
  Output voltage: 3V3
  Output current: 300mA
  Estimated efficiency: 88%
  Price estimate (Feb 2021): $1.64USD
- TI Webench Interactive Model <https://webench.ti.com/power-designer/switching-regulator/customize/16?O1I=0.3&O1V=3.3&VinMax=16.0&VinMin=9.0&action=schematic&base_pn=LMR14010A&lang_chosen=en_US&op_TA=30.0&optFactor=3&origin=ODS__LMR14010A>
- Title
- Size:
- Date:
- A3
- Number:
- Time:
- Revision:
- Sheet
- of
- File:

### Library data of the parts
C21 C22 = 100nF 50V 5% X7R 0603: as C12 on sheet STRWL-S03-V00-CAN_MAIN
C23 C24 = 22uF 35V 20% X5R 1206: 22µF ±20% 35V Ceramic Capacitor X5R 1206 (3216 Metric); ComponentLink1Description: Digikey; ComponentLink1URL: https://www.digikey.com.au/product-detail/en/tdk-corporation/C3216X5R1V226M160AC/445-8045-1-ND/2792165; ComponentLink2Description: Datasheet; ComponentLink2URL: https://product.tdk.com/info/en/catalog/datasheets/mlcc_commercial_general_en.pdf
C25 C26 = 47uF 16V 10% X7R 1210: Capacitor, Ceramic, SMD, 47uF, 16V, 5%, X7R, 1210
D6 = B260A-13-F: Diode, Schottky Barrier Rectifier, 60 V, 2 A, B260A-13-F
L2 = 74404064221: FIXED IND 220UH 660MA 850 MOHM; ComponentLink1Description: Digikey; ComponentLink1URL: https://www.digikey.com.au/product-detail/en/w%C3%BCrth-elektronik/74404064221/732-7261-1-ND/5353241; ComponentLink2Description: LCSC A; ComponentLink2URL: https://lcsc.com/product-detail/Power-Inductors_Sunlord-SWPA6045S221MT_C91047.html; ComponentLink3Description: LCSC B; ComponentLink3URL: https://lcsc.com/product-detail/Power-Inductors_SXN-Shun-Xiang-Nuo-Elec-SMNR6045-221MT_C467145.html
R24 = 64k9 1% 0603: Resistor, SMD, 64k9, 0.1W, 5%, 0603
R25 = 1k 5% 0603: Resistor, SMD, 1k, 0.1W, 5%, 0603
R26 = 19k6 1% 0603: Resistor, SMD, 19k6, 0.1W, 5%, 0603
U5 = CMP-04918-000056-1: IC REG BUCK ADJ 1A TSOT23-6; Manufacturer: Texas Instruments; Max Junction Temp: +125°C; Number Of Outputs: 1; Standoff Height: 0mm; Switching Frequency: 700kHz; Min Supply Voltage: 4V; Max Supply Voltage: 40V; Max Duty Cycle: 96%; Output Type: AdjustableProgrammable; Manufacturer Part Number: LMR14010ADDCR; Temperature: -40°C to +125°C; Output Current: 1A; Category: IC; Temperature Range High: +125°C; Lead Free: Yes; Switching Topology: Buck; Mouser Description: 4-V to 40-V, 1-A Step-Down Converter With High Efficiency Eco-Mode 6-SOT-23-THIN -40 to 125; Device Class L1: Integrated Circuits (ICs); Digikey Description: IC REG BUCK ADJ 1A TSOT23-6; Package: DDC0006A; Ipc Land Pattern Name: SOT95P280X110-6; Device Class L2: Power Management ICs; Temperature Range Low: -40°C; Height: 1.1mm; Device Class L3: Voltage Regulators - Switching; RoHS: TRUE; Automotive: No; Octopart: https://octopart.com/lmr14010addcr-texas+instruments-90753290; ComponentLink2URL: https://www.ti.com/lit/ds/symlink/lmr14010a.pdf; ComponentLink2Description: Datasheet

## Sheet STRWL-S06-V00-Peripherals.SchDoc: Peripherals
size A3; DrawnBy: John Hatfield; SheetNumber: 6; SheetTotal: 6
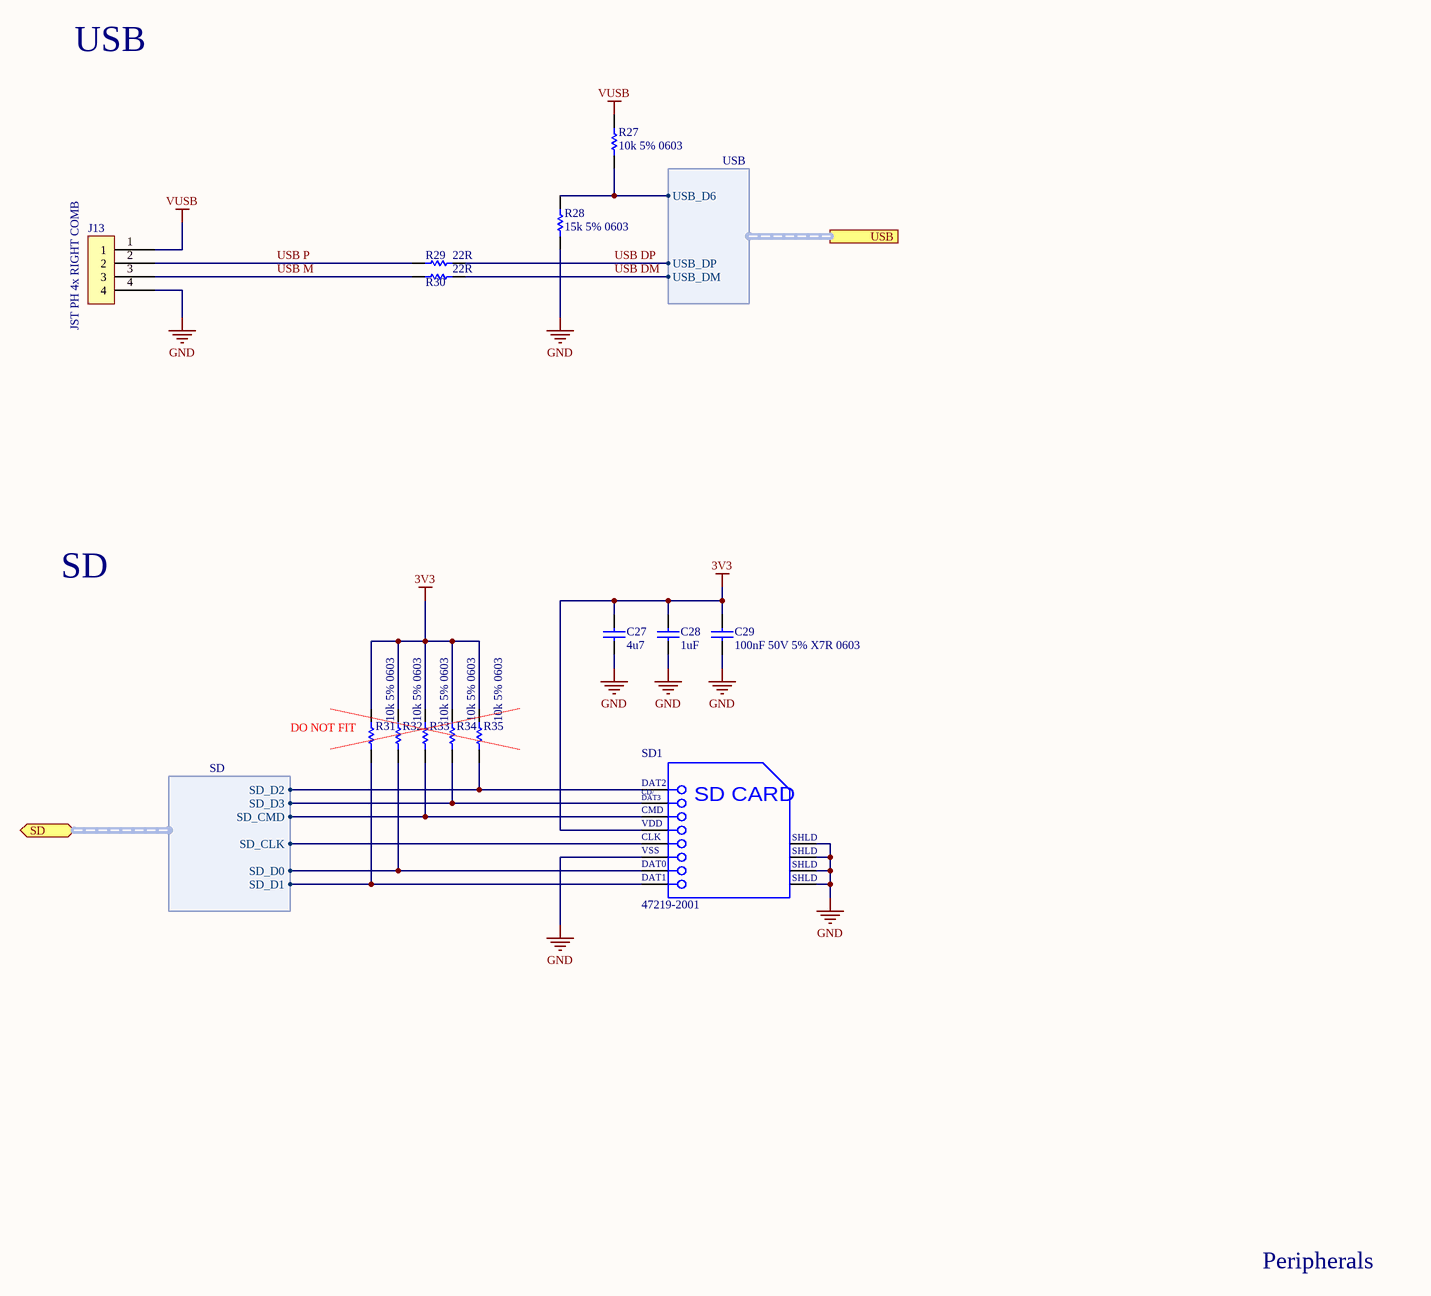
[diagram p5: STRWL-S06-V00-Peripherals.SchDoc]

### Parts
C27  4u7  [Cap_Ceramic_0603]
C28  1uF  [Cap_Ceramic_0603]
C29  100nF 50V 5% X7R 0603  [Cap_Ceramic_0603]
J13  JST PH 4x RIGHT COMB  [JST PH 4x RIGHT COMB]
R27  10k 5% 0603  [Res_ThinFilm_0603]
R28  15k 5% 0603  [Res_ThinFilm_0603]
R29  22R  [Res_ThinFilm_0603]
R30  22R  [Res_ThinFilm_0603]
R31  10k 5% 0603  [Res_ThinFilm_0603]
R32  10k 5% 0603  [Res_ThinFilm_0603]
R33  10k 5% 0603  [Res_ThinFilm_0603]
R34  10k 5% 0603  [Res_ThinFilm_0603]
R35  10k 5% 0603  [Res_ThinFilm_0603]
SD1  47219-2001  [MOLX-47219-2001-8_V]

### Ports
SD (bidir, harness SD), USB (harness USB)

### Harnesses
USB: USB_DP, USB_D6, USB_DM
SD: SD_D2, SD_D3, SD_CMD, SD_CLK, SD_D0, SD_D1

### Nets
3V3: C27.1 C27.2 C28.1 C28.2 C29.1 C29.2 J13.4 R28.1 R31.2 R32.2 R33.2 R34.2 R35.2 SD1.4(VDD) SD1.6(VSS) SD1.9(SHLD) SD1.10(SHLD) SD1.11(SHLD) SD1.12(SHLD)  [also labelled GND]
VUSB: J13.1 R27.2
SD_CMD: R33.1 SD1.3(CMD) ; port SD.SD_CMD
SD_D0: R32.1 SD1.7(DAT0) ; port SD.SD_D0
SD_D1: R31.1 SD1.8(DAT1) ; port SD.SD_D1
SD_D2: R35.1 SD1.1(DAT2) ; port SD.SD_D2
SD_D3: R34.1 SD1.2(CD/DAT3) ; port SD.SD_D3
SDIO_CK: SD1.5(CLK) ; port SD.SD_CLK
USB DM: R30.2 ; port USB.USB_DM
USB DP: R29.2 ; port USB.USB_DP
USB M: J13.3 R30.1
USB P: J13.2 R29.1
USB_D6: R27.1 R28.2 ; port USB.USB_D6

### Notes on the sheet
- USB
- SD
- (near R31) DO NOT FIT
- Peripherals
- (in symbol CMP-2000-05245-1) CD/; DAT3; SD CARD
- (in symbol 47219-2001) CD/; DAT3; SD CARD

### Library data of the parts
C27 = 4u7 50V 5% X7R 0603: as C2 on sheet STRWL-S01-V00-Master
C28 = 1uF 25V 5% X7R 0603: as C1 on sheet STRWL-S01-V00-Master
C29 = 100nF 50V 5% X7R 0603: as C12 on sheet STRWL-S03-V00-CAN_MAIN
R27 R31-R35 = 10k 5% 0603: Resistor, SMD, 10k, 0.1W, 5%, 0603
R28 = 15k 5% 0603: Resistor, SMD, 15k, 0.1W, 5%, 0603
R29 R30 = 22R 1% 0603: Resistor, SMD, 22R, 0.1W, 1%, 0603
SD1 = CMP-2000-05245-1: MicroSD Card Connector, Hinge Type, -40 to 85 degC, 8-Pin SMD, RoHS, Tape and Reel; Manufacturer: Molex; Current Rating: 500mA; Number of Contacts: 8; Pitch: 1.09mm; Insertion - Extraction Style: Hinged; Voltage Rating: 100VDC; Product: CardConnectors; Contact Material: CopperAlloy; Series: 47219; Packaging: Reel; Brand: Molex; Product Category: MemoryCardConnectors; Housing Material: Thermoplastic; Mounting Style: SMD/SMT; Termination Style: SMD; Datasheet Version: Rev. F, 06/2009; Card Type: microSD; Manufacturer URL: http://www.molex.com/; RoHS: Details; Datasheet URL: http://www.molex.com/pdm_docs/sd/472192001_sd.pdf; Factory Pack Quantity: 2400

## Nets that join several sheets
3V3: STRWL-S01-V00-Master (34 pins), STRWL-S02-V00-12VProtection (12 pins), STRWL-S03-V00-CAN_MAIN (6 pins), STRWL-S04-V00-Microcontroller (42 pins), STRWL-S05-V00-Master-PSU3V3-300mA (13 pins), STRWL-S06-V00-Peripherals (19 pins)
12V: STRWL-S01-V00-Master (J1.4), STRWL-S02-V00-12VProtection (7 pins)
12VP: STRWL-S02-V00-12VProtection (5 pins), STRWL-S05-V00-Master-PSU3V3-300mA (C23.1 C24.1 U5.4 U5.5)
BUS SEL: STRWL-S01-V00-Master (J2.8), STRWL-S04-V00-Microcontroller (U3.69)
BUS STATE: STRWL-S01-V00-Master (J2.9), STRWL-S04-V00-Microcontroller (U3.70)
BUTTON-LOW-LEFT: STRWL-S01-V00-Master (J?#5.1 R4.2), STRWL-S04-V00-Microcontroller (U3.85)
BUTTON-LOW-RIGHT: STRWL-S01-V00-Master (J?#7.1 R6.1), STRWL-S04-V00-Microcontroller (U3.87)
BUTTON-UP-LEFT: STRWL-S01-V00-Master (J?#4.1 R3.2), STRWL-S04-V00-Microcontroller (U3.84)
BUTTON-UP-RIGHT: STRWL-S01-V00-Master (J?#6.1 R5.1), STRWL-S04-V00-Microcontroller (U3.86)
CAN GLV RX: STRWL-S03-V00-CAN_MAIN (R18.1 TP4.1 U2.4), STRWL-S04-V00-Microcontroller (U3.95)
CAN GLX TX: STRWL-S03-V00-CAN_MAIN (R17.1 TP6.1 U2.1), STRWL-S04-V00-Microcontroller (U3.96)
CHIP SEL: STRWL-S01-V00-Master (J2.12), STRWL-S04-V00-Microcontroller (U3.29)
DATA/CMD: STRWL-S01-V00-Master (J2.11), STRWL-S04-V00-Microcontroller (U3.26)
POT-L: STRWL-S01-V00-Master (J?#1.2), STRWL-S04-V00-Microcontroller (U3.15)
POT-M: STRWL-S01-V00-Master (J?#2.2), STRWL-S04-V00-Microcontroller (U3.16)
POT-R: STRWL-S01-V00-Master (J?#3.2), STRWL-S04-V00-Microcontroller (U3.17)
RESET: STRWL-S01-V00-Master (J2.10), STRWL-S04-V00-Microcontroller (U3.25)
SD_CMD: STRWL-S04-V00-Microcontroller (U3.83), STRWL-S06-V00-Peripherals (R33.1 SD1.3)
SD_D0: STRWL-S04-V00-Microcontroller (U3.65), STRWL-S06-V00-Peripherals (R32.1 SD1.7)
SD_D1: STRWL-S04-V00-Microcontroller (U3.66), STRWL-S06-V00-Peripherals (R31.1 SD1.8)
SD_D2: STRWL-S04-V00-Microcontroller (U3.78), STRWL-S06-V00-Peripherals (R35.1 SD1.1)
SD_D3: STRWL-S04-V00-Microcontroller (U3.79), STRWL-S06-V00-Peripherals (R34.1 SD1.2)
SDIO_CK: STRWL-S04-V00-Microcontroller (U3.80), STRWL-S06-V00-Peripherals (SD1.5)
SERIAL CLK: STRWL-S01-V00-Master (J2.13), STRWL-S04-V00-Microcontroller (U3.30)
SERIAL DATA: STRWL-S01-V00-Master (J2.14), STRWL-S04-V00-Microcontroller (U3.31)
TEMP CLK: STRWL-S01-V00-Master (J2.6), STRWL-S04-V00-Microcontroller (U3.67)
TEMP DATA: STRWL-S01-V00-Master (J2.7), STRWL-S04-V00-Microcontroller (U3.68)
USB DM: STRWL-S04-V00-Microcontroller (U3.53), STRWL-S06-V00-Peripherals (R30.2)
USB DP: STRWL-S04-V00-Microcontroller (U3.54), STRWL-S06-V00-Peripherals (R29.2)
USB_D6: STRWL-S04-V00-Microcontroller (U3.52), STRWL-S06-V00-Peripherals (R27.1 R28.2)